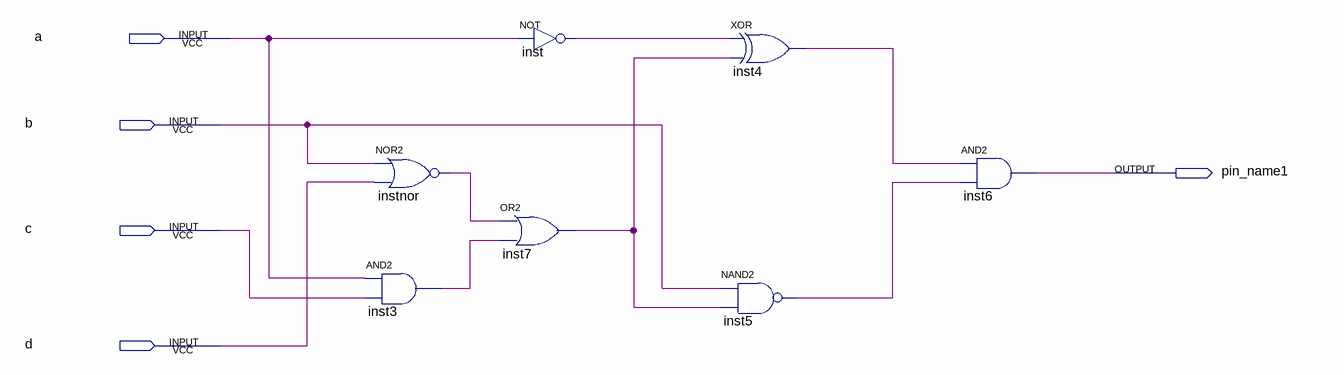
[diagram p0: schematic sheet]
// Quartus schematic Problema422.bdf as structural Verilog: 7 symbols, 5 pins
module Problema422 (
  input  a,
  input  b,
  input  c,
  input  d,
  output pin_name1
);

  wire inst3_out, inst4_out, inst5_out, inst7_out, inst_out, instnor_out;

  nor instnor (instnor_out, b, d);
  and inst3 (inst3_out, a, c);
  not inst (inst_out, a);
  or inst7 (inst7_out, instnor_out, inst3_out);
  xor inst4 (inst4_out, inst_out, inst7_out);
  nand inst5 (inst5_out, b, inst7_out);
  and inst6 (pin_name1, inst4_out, inst5_out);
endmodule
